# Altium schematic sheet RTC.SchDoc
size A4; Revision: 0
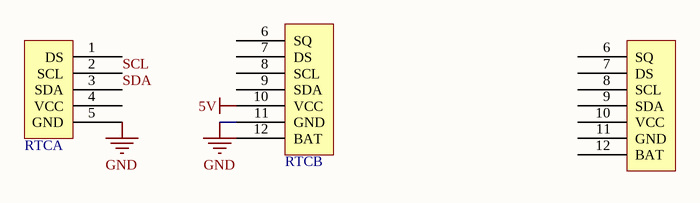
[diagram p0: RTC.SchDoc]

## Parts
RTC  TinyRTC  [Tiny RTC]  (value not drawn)  (parts A,B of 2)
RTCB  TinyRTC  [Tiny RTC]  (value not drawn)  (part B of 2)  (mechanical)

## Nets
5V: RTC.10(VCC)
GND: RTC.5(GND) RTC.11(GND)
SCL: RTC.2(SCL)
SDA: RTC.3(SDA)

Not connected (* = marked no-connect by the designer): RTC 1(DS) 4(VCC) 6(SQ) 7(DS) 8(SCL) 9(SDA) 12(BAT); RTCB 6(SQ) 7(DS) 8(SCL) 9(SDA) 10(VCC) 11(GND) 12(BAT)

## Notes on the sheet
- Title
- Size:
- Date:
- A4
- Number:
- Time:
- Revision:
- Sheet
- of
- File:

## Library data of the parts
RTC = TinyRTC: Embase PCB, Carte-à-carte, 2.54 mm, 1 Rangée(s), 5 Contact(s), Montage traversant, SSW Series; Fabricant: SAMTEC; Fournisseur: Farnell; RefFabricant: SSW-105-01-G-S; RefFournisseur: 2578707; Valeur: 5 cts
RTCB = TinyRTC: Embase PCB, Carte-à-carte, 2.54 mm, 1 Rangée(s), 7 Contact(s), Montage traversant, SSW Series; Fabricant: SAMTEC; Fournisseur: Farnell; RefFabricant: SSW-107-01-G-S; RefFournisseur: 2984569; Valeur: 7 cts